# Altium schematic sheet CLOCK.SchDoc
size A4
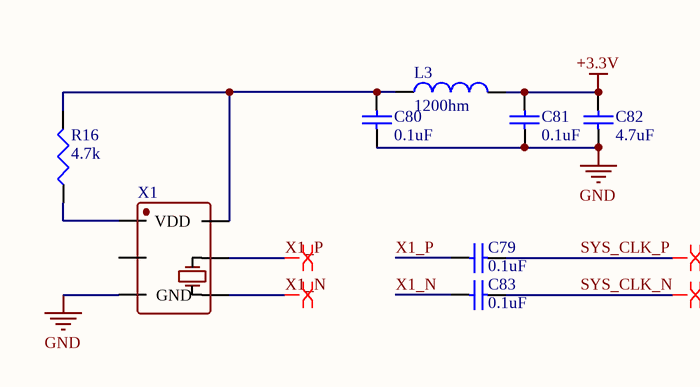
[diagram p0: CLOCK.SchDoc]

## Parts
C79  value 0.1uF  [0402]  (hidden comment: Cap Semi)
C80  value 0.1uF  [0402]  (hidden comment: Cap Semi)
C81  value 0.1uF  [0402]  (hidden comment: Cap Semi)
C82  value 4.7uF  [0402]  (hidden comment: Cap Semi)
C83  value 0.1uF  [0402]  (hidden comment: Cap Semi)
L3  value 1200hm  [0402-A]  (hidden comment: Inductor)
R16  value 4.7k  [J1-0603]  (hidden comment: Res3)
X1  晶振  [OSC6-5X7]  (value not drawn)

## Nets
+3.3V: C81.2 C82.2 L3.2
GND: C80.1 C81.1 C82.1 X1.3(GND)
SYS_CLK_N: C83.2
SYS_CLK_P: C79.2
X1_N: C83.1 X1.4
X1_P: C79.1 X1.5
NetC80_2: C80.2 L3.1 R16.2 X1.6(VDD)
NetR16_1: R16.1 X1.1(E/D)

Not connected (* = marked no-connect by the designer): X1 2(E/D)

## Layout directives
differential pair: SYS_CLK_N, SYS_CLK_P, X1_N, X1_P

## Library data of the parts
C79-C83 = Cap Semi: Capacitor (Semiconductor SIM Model); Published: 8-Jun-2000; LatestRevisionDate: 29-May-2009; LatestRevisionNote: IPC-7351 Footprint Added.; PackageReference: C1206; Publisher: Altium Limited; PackageDescription: Chip Capacitor
L3 = Inductor: Code_IEC: 1005; Published: 8-Jun-2000; LatestRevisionDate: 29-May-2009; LatestRevisionNote: IPC-7351 Footprint Added.; PackageReference: 0402-A; Publisher: Altium Limited; PackageDescription: Chip Inductor; Code_JEITA: 0402
R16 = Res3: Resistor; Published: 8-Jun-2000; LatestRevisionDate: 29-May-2009; LatestRevisionNote: IPC-7351 Footprint Added.; PackageReference: J1-0603; Publisher: Altium Limited; PackageDescription: Chip Resistor